# EAGLE design DroneController (EAGLE 9.6.2)

## Sheet 1 of 4
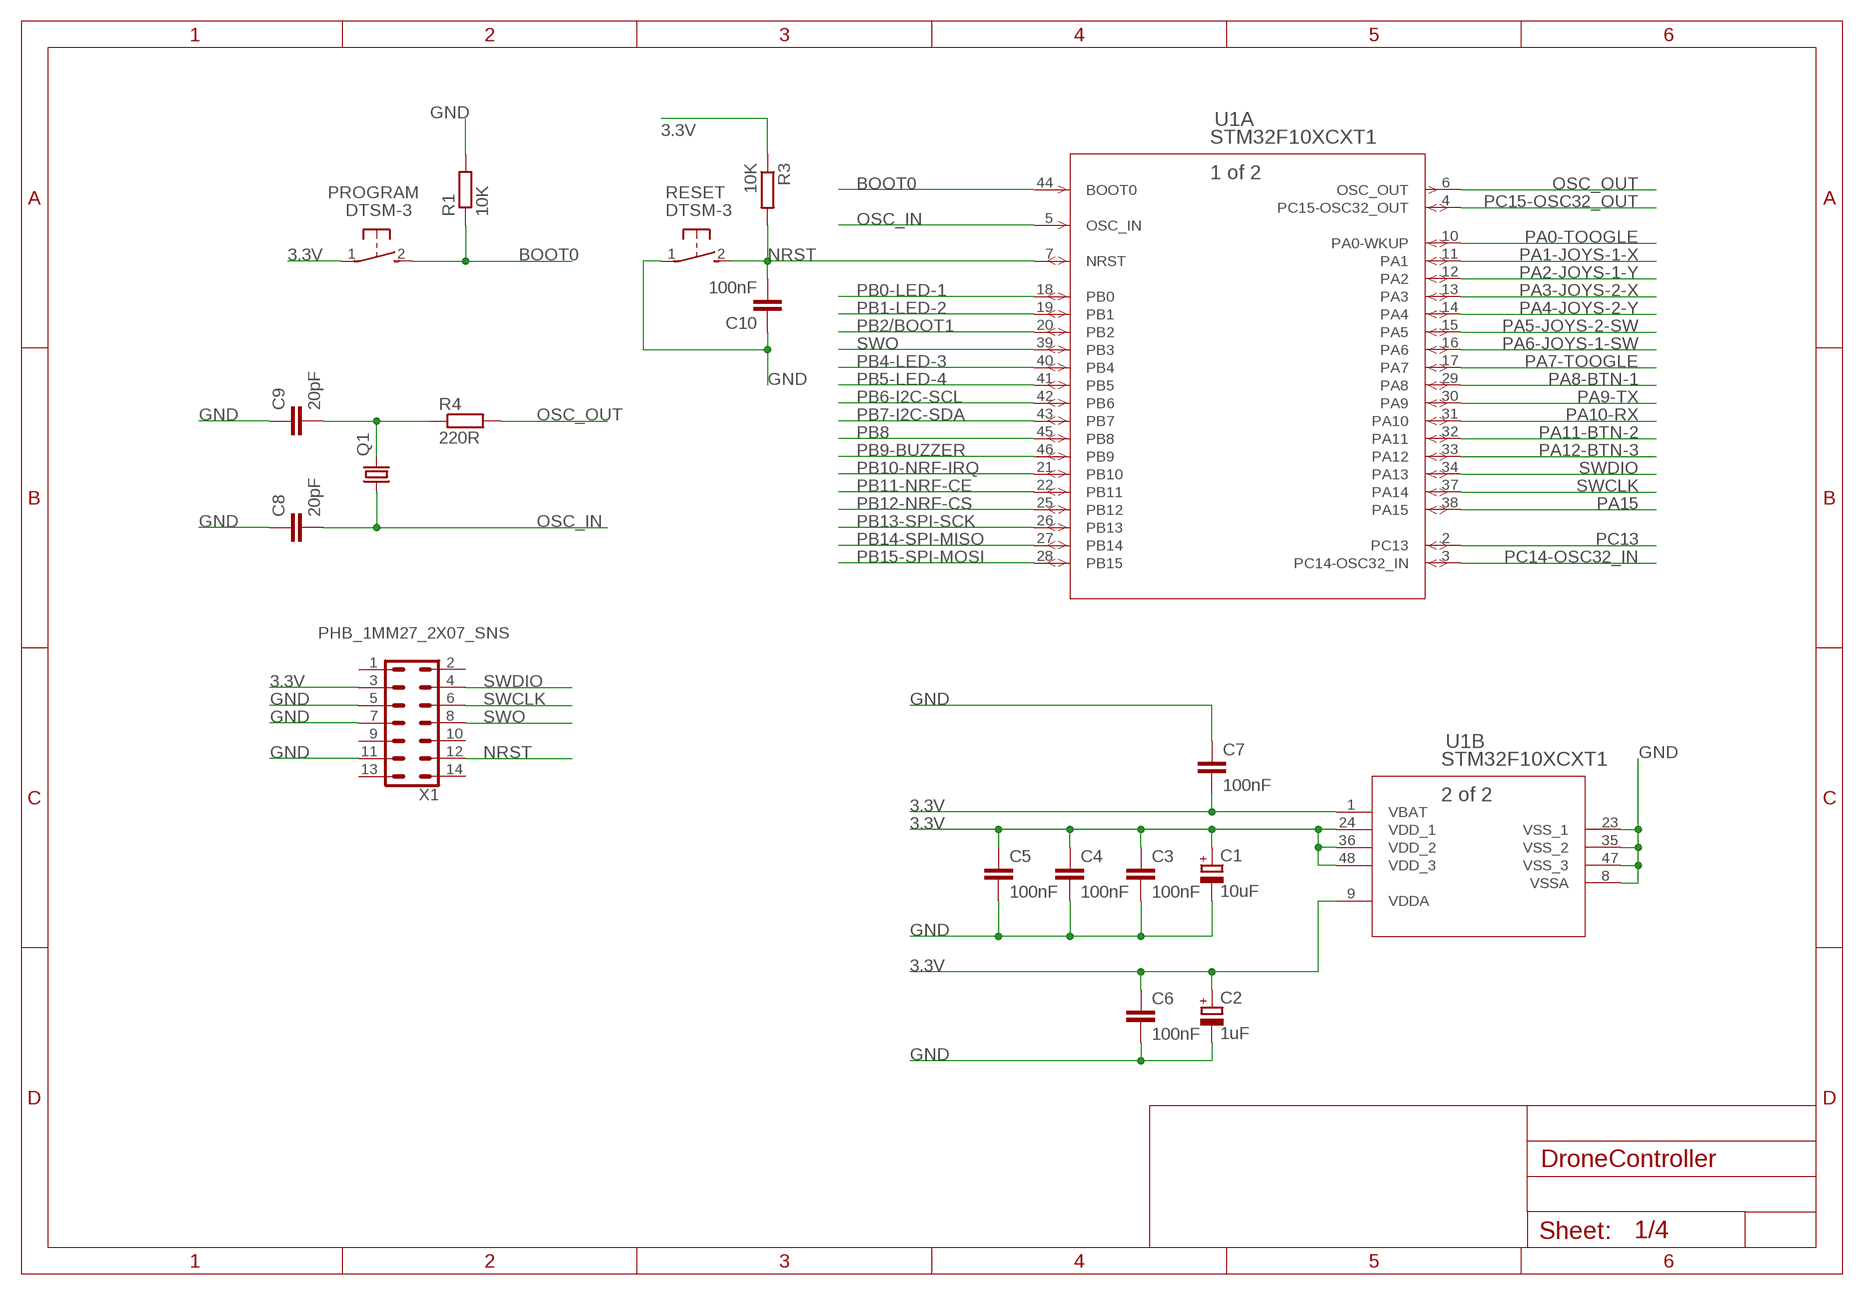
[diagram p0: schematic, sheet 1]

### Parts
C1  10uF  CPOL-EUSMCA  [SMC_A]
C2  1uF  CPOL-EUSMCA  [SMC_A]
C3  100nF  C-EUC0805  [C0805]
C4  100nF  C-EUC0805  [C0805]
C5  100nF  C-EUC0805  [C0805]
C6  100nF  C-EUC0805  [C0805]
C7  100nF  C-EUC0805  [C0805]
C8  20pF  C-EUC0805  [C0805]
C9  20pF  C-EUC0805  [C0805]
C10  100nF  C-EUC0805  [C0805]
PROGRAM  DTSM-3  [DTSM-3]
Q1  CRYSTALHC49S  [HC49/S]
R1  10K  R-EU_R0805  [R0805]
R3  10K  R-EU_R0805  [R0805]
R4  220R  R-EU_R0805  [R0805]
RESET  DTSM-3  [DTSM-3]
U1  STM32F10XCXT1  [LQFP48-7X7MM]
X1  PHB_1MM27_2X07_SNS  [PHB_1MM27_2X07_SNS]

### Nets
3.3V: C1.+ C2.+ C3.1 C4.1 C5.1 C6.1 C7.2 PROGRAM.1 R3.1 U1.1(B:VBAT) U1.9(B:VDDA) U1.24(B:VDD_1) U1.36(B:VDD_2) U1.48(B:VDD_3) X1.3 ; also sheet 2,3,4
BOOT0: PROGRAM.2 R1.1 U1.44(A:BOOT0)
GND: C1.- C2.- C3.2 C4.2 C5.2 C6.2 C7.1 C8.1 C9.1 C10.1 R1.2 RESET.1 U1.8(B:VSSA) U1.23(B:VSS_1) U1.35(B:VSS_2) U1.47(B:VSS_3) X1.5 X1.7 X1.11 ; also sheet 2,3,4
N$5: C9.2 Q1.2 R4.1
NRST: C10.2 R3.2 RESET.2 U1.7(A:NRST) X1.12
OSC_IN: C8.2 Q1.1 U1.5(A:OSC_IN)
OSC_OUT: R4.2 U1.6(A:OSC_OUT)
PA0-TOOGLE: U1.10(A:PA0-WKUP) ; also sheet 3
PA1-JOYS-1-X: U1.11(A:PA1) ; also sheet 3
PA2-JOYS-1-Y: U1.12(A:PA2) ; also sheet 3
PA3-JOYS-2-X: U1.13(A:PA3) ; also sheet 3
PA4-JOYS-2-Y: U1.14(A:PA4) ; also sheet 3
PA5-JOYS-2-SW: U1.15(A:PA5) ; also sheet 3
PA6-JOYS-1-SW: U1.16(A:PA6) ; also sheet 3
PA7-TOOGLE: U1.17(A:PA7)
PA8-BTN-1: U1.29(A:PA8) ; also sheet 3
PA9-TX: U1.30(A:PA9)
PA10-RX: U1.31(A:PA10)
PA11-BTN-2: U1.32(A:PA11) ; also sheet 3
PA12-BTN-3: U1.33(A:PA12) ; also sheet 3
PA15: U1.38(A:PA15)
PB0-LED-1: U1.18(A:PB0) ; also sheet 3
PB1-LED-2: U1.19(A:PB1) ; also sheet 3
PB2/BOOT1: U1.20(A:PB2)
PB4-LED-3: U1.40(A:PB4) ; also sheet 3
PB5-LED-4: U1.41(A:PB5) ; also sheet 3
PB6-I2C-SCL: U1.42(A:PB6) ; also sheet 2
PB7-I2C-SDA: U1.43(A:PB7) ; also sheet 2
PB8: U1.45(A:PB8)
PB9-BUZZER: U1.46(A:PB9)
PB10-NRF-IRQ: U1.21(A:PB10) ; also sheet 2
PB11-NRF-CE: U1.22(A:PB11) ; also sheet 2
PB12-NRF-CS: U1.25(A:PB12) ; also sheet 2
PB13-SPI-SCK: U1.26(A:PB13) ; also sheet 2
PB14-SPI-MISO: U1.27(A:PB14) ; also sheet 2
PB15-SPI-MOSI: U1.28(A:PB15) ; also sheet 2
PC13: U1.2(A:PC13)
PC14-OSC32_IN: U1.3(A:PC14-OSC32_IN)
PC15-OSC32_OUT: U1.4(A:PC15-OSC32_OUT)
SWCLK: U1.37(A:PA14) X1.6
SWDIO: U1.34(A:PA13) X1.4
SWO: U1.39(A:PB3) X1.8
Unconnected: X1.1 X1.2 X1.9 X1.10 X1.13 X1.14

## Sheet 2 of 4
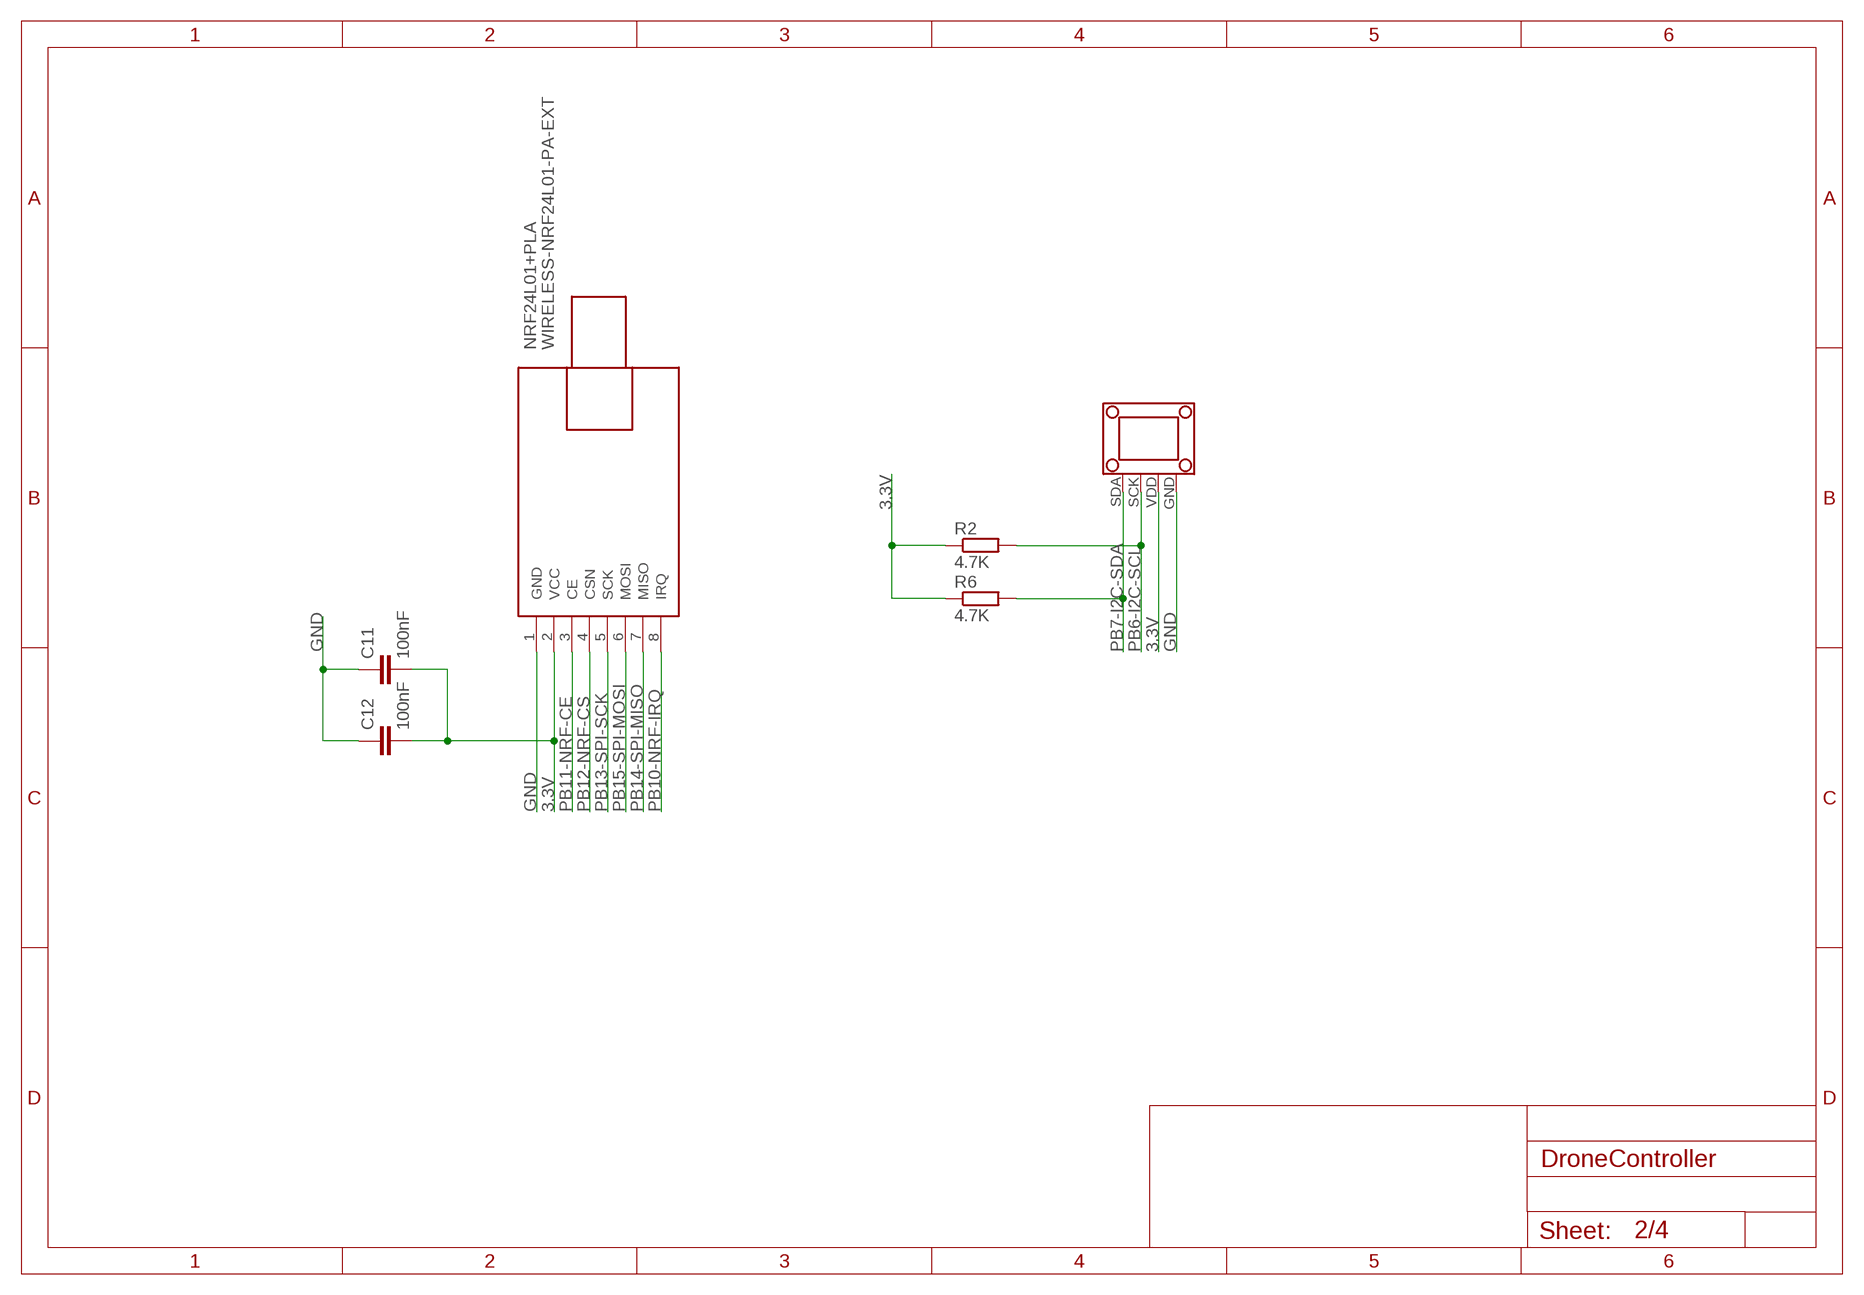
[diagram p1: schematic, sheet 2]

### Parts
C11  100nF  C-EUC0805  [C0805]
C12  100nF  C-EUC0805  [C0805]
NRF24L01+PLA  WIRELESS-NRF24L01-PA-EXT  [WIRELESS-NRF24L01-PA-EXT]
R2  4.7K  R-EU_R0805  [R0805]
R6  4.7K  R-EU_R0805  [R0805]
U$1  1.3_TFT_OLED  [1.3_TFT_OLED]

### Nets
3.3V: C11.2 C12.2 NRF24L01+PLA.2(VCC) R2.1 R6.1 U$1.VDD ; also sheet 1,3,4
GND: C11.1 C12.1 NRF24L01+PLA.1(GND) U$1.GND ; also sheet 1,3,4
PB6-I2C-SCL: R2.2 U$1.SCK ; also sheet 1
PB7-I2C-SDA: R6.2 U$1.SDA ; also sheet 1
PB10-NRF-IRQ: NRF24L01+PLA.8(IRQ) ; also sheet 1
PB11-NRF-CE: NRF24L01+PLA.3(CE) ; also sheet 1
PB12-NRF-CS: NRF24L01+PLA.4(CSN) ; also sheet 1
PB13-SPI-SCK: NRF24L01+PLA.5(SCK) ; also sheet 1
PB14-SPI-MISO: NRF24L01+PLA.7(MISO) ; also sheet 1
PB15-SPI-MOSI: NRF24L01+PLA.6(MOSI) ; also sheet 1

## Sheet 3 of 4
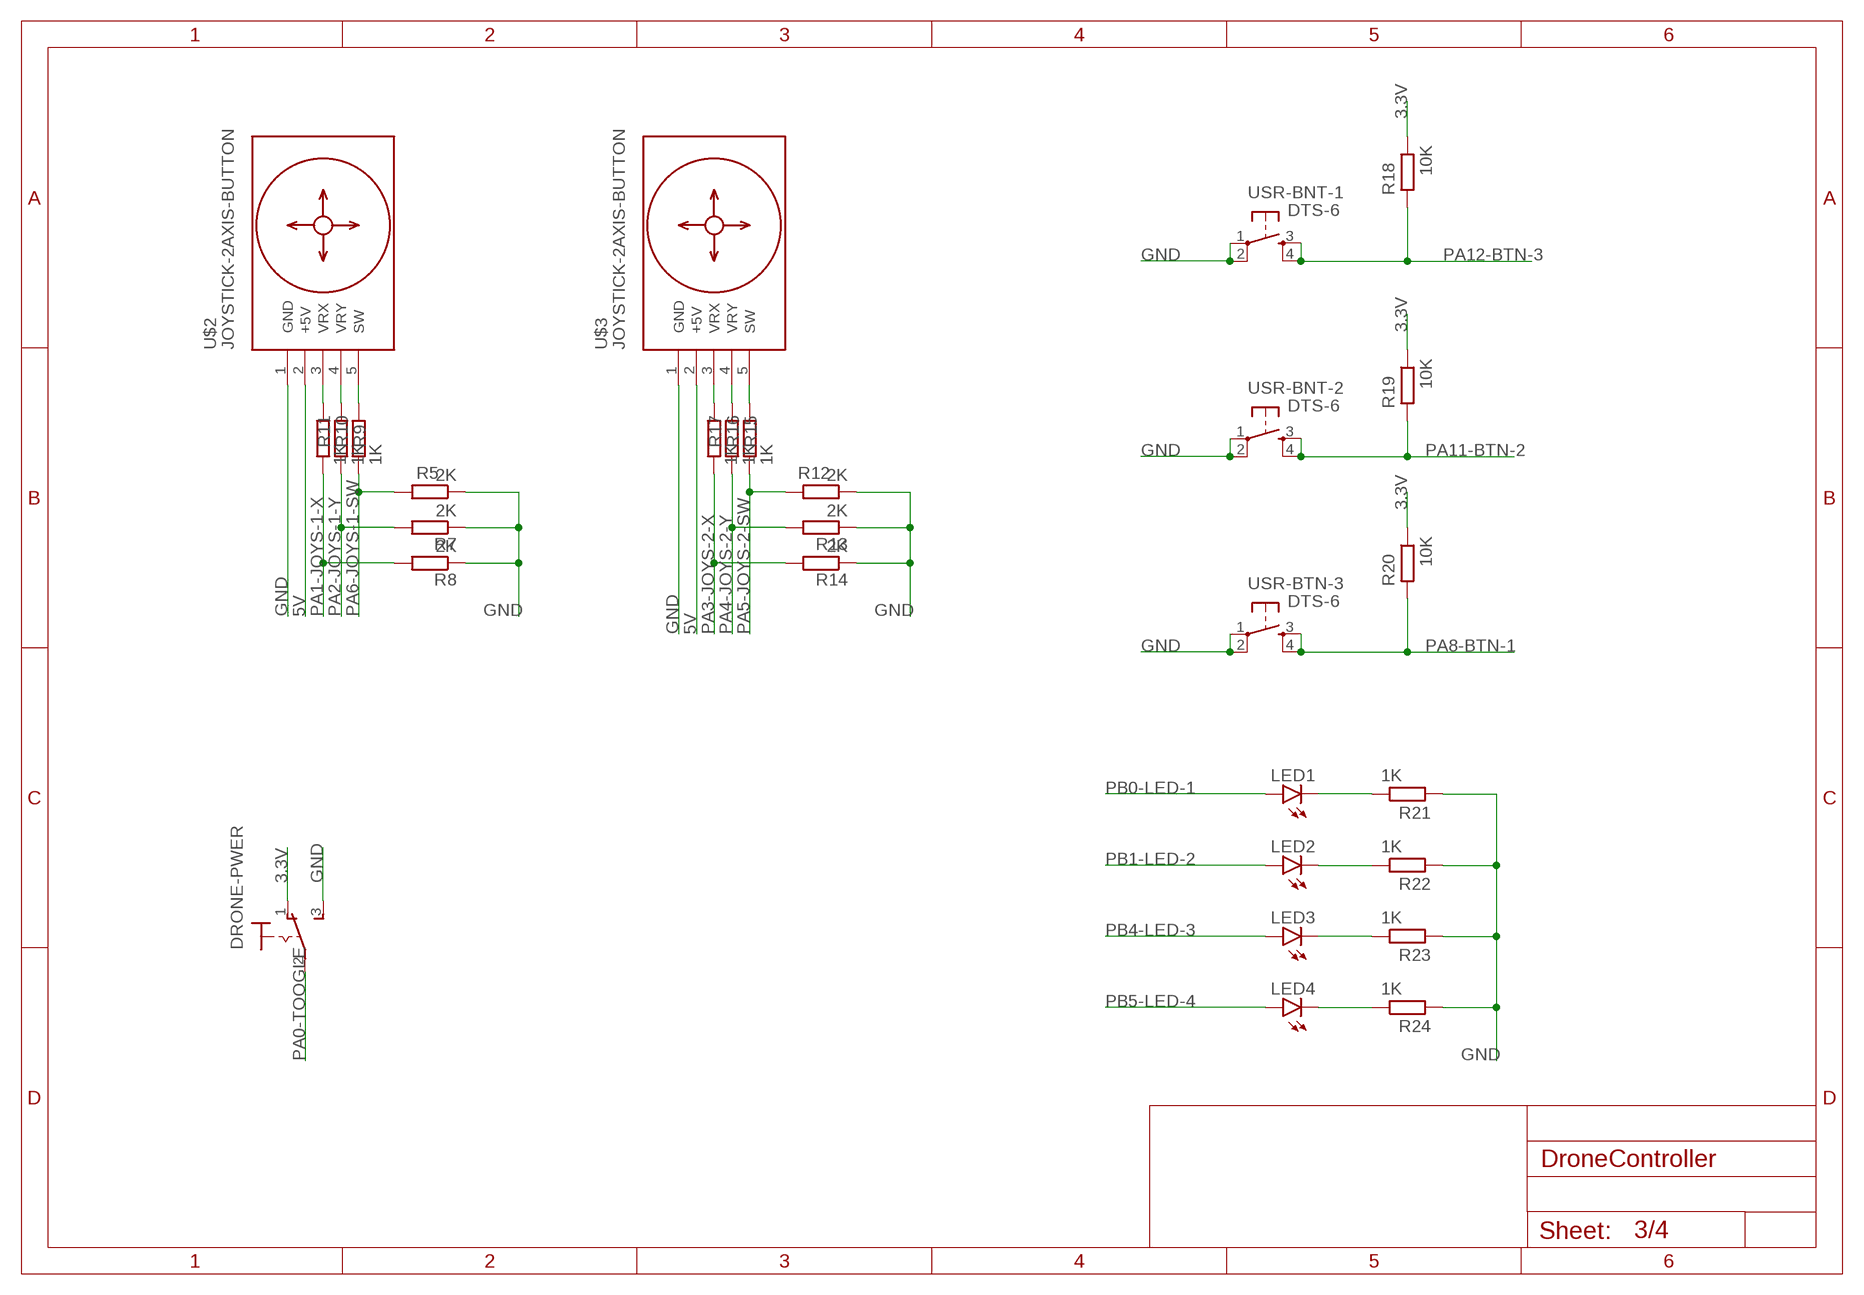
[diagram p2: schematic, sheet 3]

### Parts
DRONE-PWER  M9040P  [M9040P]
LED1  LEDCHIP-LED0805  [CHIP-LED0805]
LED2  LEDCHIP-LED0805  [CHIP-LED0805]
LED3  LEDCHIP-LED0805  [CHIP-LED0805]
LED4  LEDCHIP-LED0805  [CHIP-LED0805]
R5  2K  R-EU_R0805  [R0805]
R7  2K  R-EU_R0805  [R0805]
R8  2K  R-EU_R0805  [R0805]
R9  1K  R-EU_R0805  [R0805]
R10  1K  R-EU_R0805  [R0805]
R11  1K  R-EU_R0805  [R0805]
R12  2K  R-EU_R0805  [R0805]
R13  2K  R-EU_R0805  [R0805]
R14  2K  R-EU_R0805  [R0805]
R15  1K  R-EU_R0805  [R0805]
R16  1K  R-EU_R0805  [R0805]
R17  1K  R-EU_R0805  [R0805]
R18  10K  R-EU_R0805  [R0805]
R19  10K  R-EU_R0805  [R0805]
R20  10K  R-EU_R0805  [R0805]
R21  1K  R-EU_R0805  [R0805]
R22  1K  R-EU_R0805  [R0805]
R23  1K  R-EU_R0805  [R0805]
R24  1K  R-EU_R0805  [R0805]
U$2  JOYSTICK-2AXIS-BUTTON  [JOYSTICK-2AXIS-BUTTON]
U$3  JOYSTICK-2AXIS-BUTTON  [JOYSTICK-2AXIS-BUTTON]
USR-BNT-1  DTS-6  [DTS-6]
USR-BNT-2  DTS-6  [DTS-6]
USR-BTN-3  DTS-6  [DTS-6]

### Nets
3.3V: DRONE-PWER.1(O) R18.1 R19.1 R20.1 ; also sheet 1,2,4
5V: U$2.2(+5V) U$3.2(+5V) ; also sheet 4
GND: DRONE-PWER.3(S) R5.1 R7.1 R8.1 R12.1 R13.1 R14.1 R21.2 R22.2 R23.2 R24.2 U$2.1(GND) U$3.1(GND) USR-BNT-1.1 USR-BNT-1.2 USR-BNT-2.1 USR-BNT-2.2 USR-BTN-3.1 USR-BTN-3.2 ; also sheet 1,2,4
N$1: R11.2 U$2.3(VRX)
N$2: R10.2 U$2.4(VRY)
N$3: R9.2 U$2.5(SW)
N$4: R17.2 U$3.3(VRX)
N$6: R16.2 U$3.4(VRY)
N$7: LED4.C R24.1
N$8: R15.2 U$3.5(SW)
N$10: LED3.C R23.1
N$11: LED2.C R22.1
N$12: LED1.C R21.1
PA0-TOOGLE: DRONE-PWER.2(P) ; also sheet 1
PA1-JOYS-1-X: R8.2 R11.1 ; also sheet 1
PA2-JOYS-1-Y: R7.2 R10.1 ; also sheet 1
PA3-JOYS-2-X: R14.2 R17.1 ; also sheet 1
PA4-JOYS-2-Y: R13.2 R16.1 ; also sheet 1
PA5-JOYS-2-SW: R12.2 R15.1 ; also sheet 1
PA6-JOYS-1-SW: R5.2 R9.1 ; also sheet 1
PA8-BTN-1: R20.2 USR-BTN-3.3 USR-BTN-3.4 ; also sheet 1
PA11-BTN-2: R19.2 USR-BNT-2.3 USR-BNT-2.4 ; also sheet 1
PA12-BTN-3: R18.2 USR-BNT-1.3 USR-BNT-1.4 ; also sheet 1
PB0-LED-1: LED1.A ; also sheet 1
PB1-LED-2: LED2.A ; also sheet 1
PB4-LED-3: LED3.A ; also sheet 1
PB5-LED-4: LED4.A ; also sheet 1

## Sheet 4 of 4
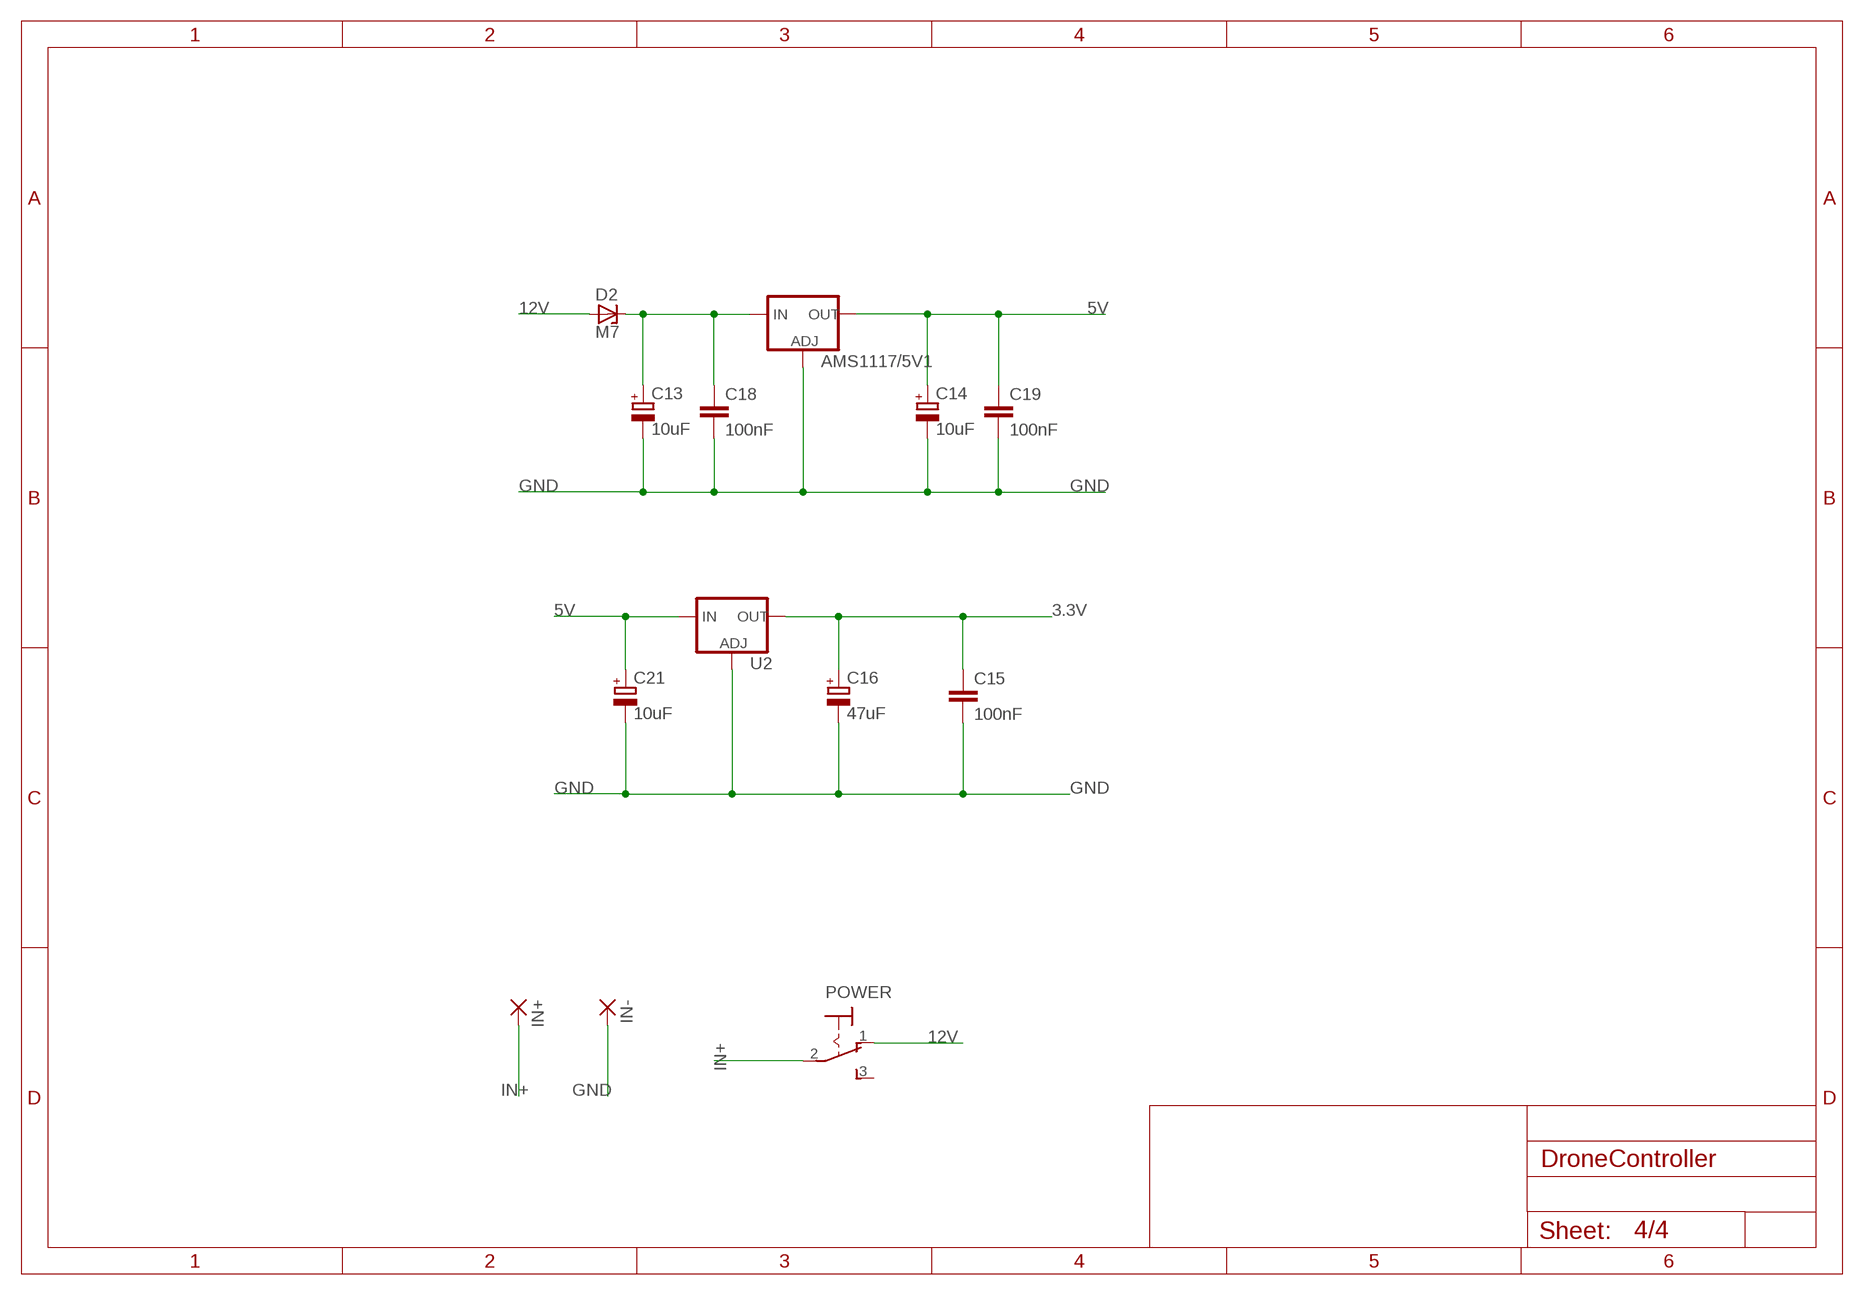
[diagram p3: schematic, sheet 4]

### Parts
AMS1117/5V1  V_REG_LM1117SOT223  [SOT223]
C13  10uF  CPOL-EUSMCA  [SMC_A]
C14  10uF  CPOL-EUSMCA  [SMC_A]
C15  100nF  C-EUC0805  [C0805]
C16  47uF  CPOL-EUSMCB  [SMC_B]
C18  100nF  C-EUC0805  [C0805]
C19  100nF  C-EUC0805  [C0805]
C21  10uF  CPOL-EUSMCA  [SMC_A]
D2  M7  1SMA5913BT3G  [DO214AC]
IN+  2,15/1,0  [2,15/1,0]
IN-  2,15/1,0  [2,15/1,0]
POWER  M9040P  [M9040P]
U2  V_REG_LM1117SOT223  [SOT223]

### Nets
3.3V: C15.1 C16.+ U2.2(OUT) U2.4(OUT) ; also sheet 1,2,3
5V: AMS1117/5V1.2(OUT) AMS1117/5V1.4(OUT) C14.+ C19.1 C21.+ U2.3(IN) ; also sheet 3
12V: D2.A POWER.1(O)
GND: AMS1117/5V1.1(ADJ) C13.- C14.- C15.2 C16.- C18.2 C19.2 C21.- IN-.1(P) U2.1(ADJ) ; also sheet 1,2,3
IN+: IN+.1(P) POWER.2(P)
N$9: AMS1117/5V1.3(IN) C13.+ C18.1 D2.C
Unconnected: POWER.3(S)

## Library data of the parts
AMS1117/5V1 U2 = SparkFun-IC-Power:V_REG_LM1117: Voltage Regulator LM1117 Standard adjustable voltage regulator but in SMD form. Spark Fun Electronics SKU : COM-00595; PROD_ID: VREG-08170
C1 C2 C13 C14 C16 C21 = rcl:CPOL-EU: POLARIZED CAPACITOR, European symbol; SPICEPREFIX: C
C3-C12 C15 C18 C19 = rcl:C-EU: CAPACITOR, European symbol; SPICEPREFIX: C
D2 = 1sma59xx_10:1SMA59*BT3G: 1SMA59xxBT3G Series 1.5 Watt Plastic Surface Mount Zener Voltage Regulators Source: http://www.onsemi.com/pub_link/Collateral/1SMA5913BT3-D.PDF; MF: ON Semiconductor; MPN: 1SMA5913BT3G; OC_FARNELL: 1431138; OC_NEWARK: 26K5252
DRONE-PWER POWER = switch:M9040P: TOGGLE SWITCH Marquardt
IN+ IN- = wirepad:2,15/1,0: THROUGH-HOLE PAD
LED1-LED4 = led:LED: LED OSRAM: - CHIPLED LG R971, LG N971, LY N971, LG Q971, LY Q971, LO R971, LY R971 LH N974, LH R974 LS Q976, LO Q976, LY Q976 LO Q996 - Hyper CHIPLED LW Q18S LB Q993, LB Q99A, LB R99A - SideLED LS A670, LO A670, LY A670, LG A670, LP A670 LB A673, LV A673, LT A673, LW A673 LH A674 LY A675 LS A676, LA A676, LO A676, LY A676, LW A676 LS A679, LY A679, LG A679 - Hyper Micro SIDELED® LS Y876, LA Y876, LO Y876, LY Y876 LT Y87S - SmartLED LW L88C, LW L88S LB L89C, LB L89S, LG L890 LS L89K, LO L89K, LY L89K LS L896, LA L896, LO L896, LY L896 - TOPLED LS T670, LO T670, LY T670, LG T670, LP T670 LSG T670, LSP T670, LSY T670, LOP T670, LYG T670 LG T671, LOG T671, LSG T671 LB T673, LV T673, LT T673, LW T673 LH T674 LS T676, LA T676, LO T676, LY T676, LB T676, LH T676, LSB T676, LW T676 LB T67C, LV T67C, LT T67C, LS T67K, LO T67K, LY T67K, LW E67C LS E67B, LA E67B, LO E67B, LY E67B, LB E67C, LV E67C, LT E67C LW T67C LS T679, LY T679, LG T679 LS T770, LO T770, LY T770, LG T770, LP T770 LB T773, LV T773, LT T773, LW T773 LH T774 LS E675, LA E675, LY E675, LS T675 LS T776, LA T776, LO T776, LY T776, LB T776 LHGB T686 LT T68C, LB T68C - Hyper Mini TOPLED® LB M676 - Mini TOPLED Santana® LG M470 LS M47K, LO M47K, LY M47K Source: http://www.osram.convergy.de LUXEON: - LUMILED® LXK2-PW12-R00, LXK2-PW12-S00, LXK2-PW14-U00, LXK2-PW14-V00 LXK2-PM12-R00, LXK2-PM12-S00, LXK2-PM14-U00 LXK2-PE12-Q00, LXK2-PE12-R00, LXK2-PE12-S00, LXK2-PE14-T00, LXK2-PE14-U00 LXK2-PB12-K00, LXK2-PB12-L00, LXK2-PB12-M00, LXK2-PB14-N00, LXK2-PB14-P00, LXK2-PB14-Q00 LXK2-PR12-L00, LXK2-PR12-M00, LXK2-PR14-Q00, LXK2-PR14-R00 LXK2-PD12-Q00, LXK2-PD12-R00, LXK2-PD12-S00 LXK2-PH12-R00, LXK2-PH12-S00 LXK2-PL12-P00, LXK2-PL12-Q00, LXK2-PL12-R00 Source: www.luxeon.com KINGBRIGHT: KA-3528ASYC Source: www.kingbright.com
NRF24L01+PLA = diy-modules:WIRELESS-NRF24L01-PA-EXT: 2.4 GHz Wireless Module based on NRF24L01 chip with preamplifier and external antenna Click here to find device on ebay.com <http://www.ebay.com/sch/nrf24l01+pa+lna+sma>
PROGRAM RESET = switch-tact:DTSM-3
Q1 = crystal:CRYSTAL: CRYSTAL; OC_FARNELL: 1667008; OC_NEWARK: unknown
R1-R24 = rcl:R-EU_: RESISTOR, European symbol; SPICEPREFIX: R
U1 = STM32F10XCXT1:STM32F10XCXT1; COPYRIGHT: Copyright (C) 2016 Accelerated Designs. All rights reserved; MANUFACTURER_PART_NUMBER: STM32F10XCXT1; VENDOR: STMicroelectronics
U$1 = 1.3 Inch Oled TFT:1.3_TFT_OLED
U$2 U$3 = diy-modules:JOYSTICK-2AXIS-BUTTON: 2-Axis Analog Joystick with Push Button Tutorial is available here: http://henrysbench.capnfatz.com/henrys-bench/arduino-sensors-and-input/arduino-ps2-joystick-tutorial-keyes-ky-023-deek-robot/ Click here to find device on ebay.com <http://www.ebay.com/sch/joystick+ps2+module>
USR-BNT-1 USR-BNT-2 USR-BTN-3 = switch-tact:DTS-6
X1 = pinhead-box-1.27mm:PHB_1MM27_2X07_*: Pin Header Box-Type, 1.27mm/0.5"/50mil Pitch, 2x07 Circuits Note: see library description for an important note about THT-version

## Board
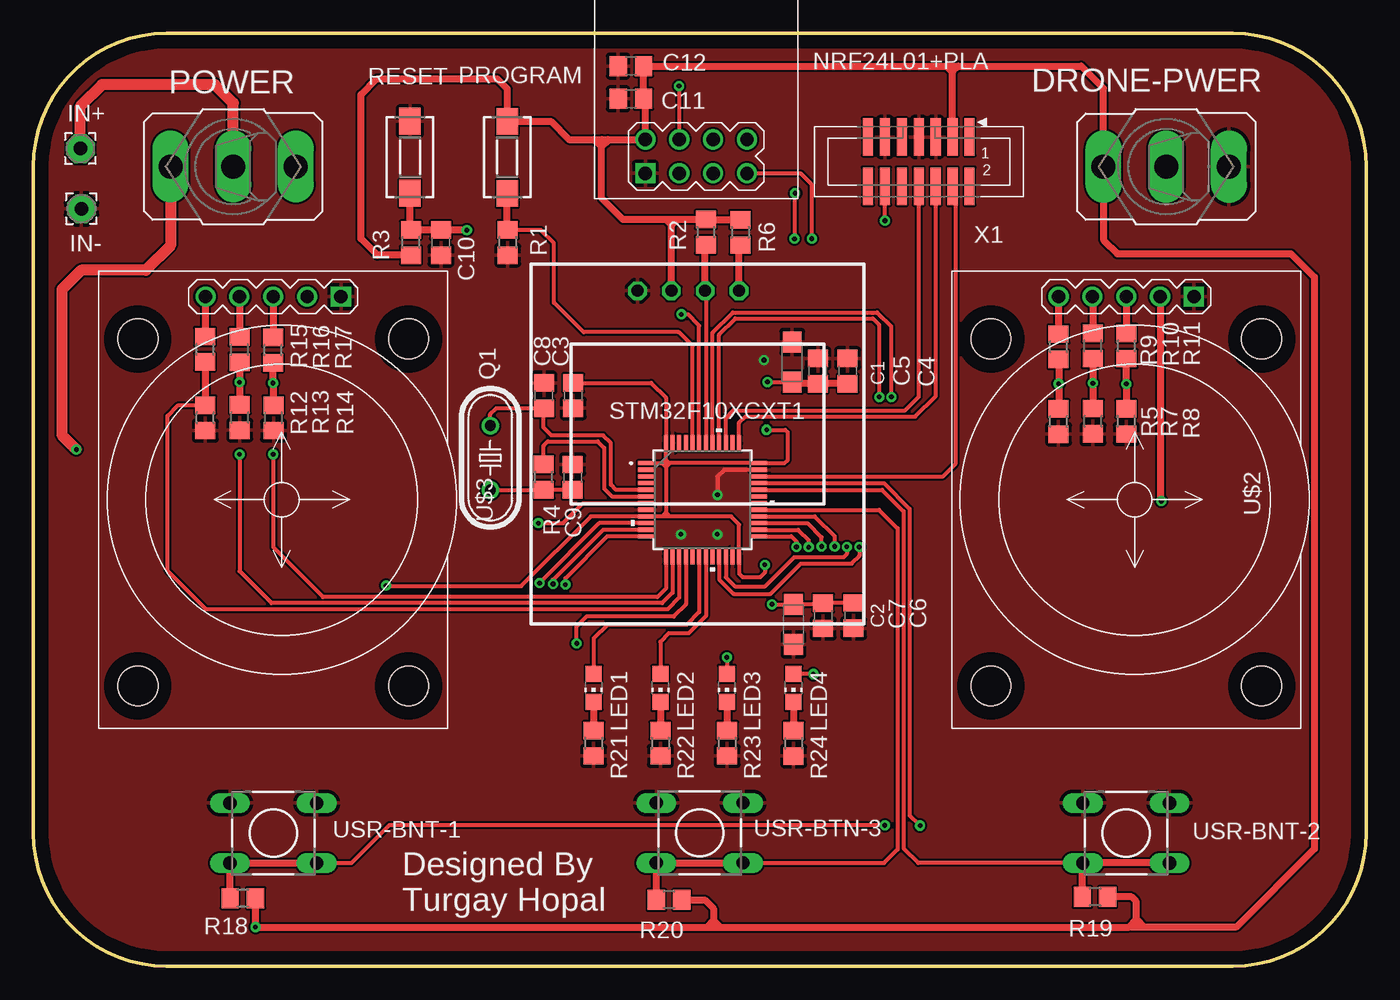
[diagram p4: board, top side]
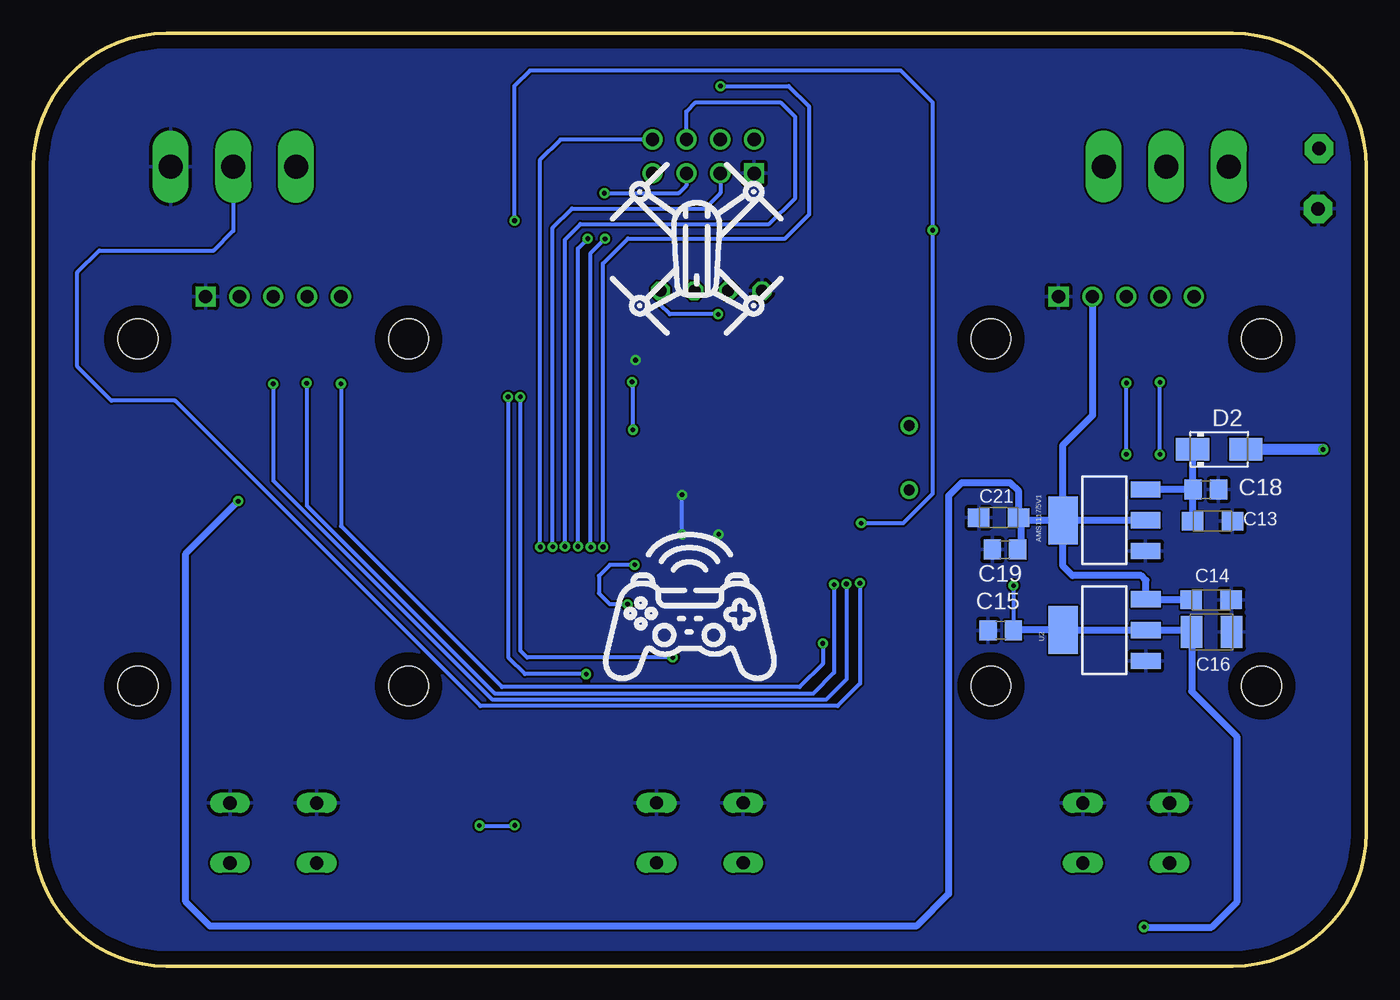
[diagram p5: board, bottom side, seen from below]

Size 100 x 70 mm. Coordinates in mm from the lower left corner, seen from the top.
Outline: 10,0 90,0 arc90 100,10 100,60 arc90 90,70 10,70 arc90 0,60 0,10 arc90 10,0
Copper layers (1*16): Top 0.035mm / dielectric 1.5mm / Bottom 0.035mm
Design rules "default": minimum track width 6mil, minimum drill 0.35mm, track to track 6mil, track to pad 6mil, pad to pad 6mil, via to via 6mil, smd to smd 6mil, copper to edge 40mil, drill to drill 6mil, minimum pad ring 10mil, minimum via ring 8mil, stop-mask expansion 4mil, vias tented up to drill 0mil, thermal gap 10mil

### Footprints (pad centres in the part's own frame; a part is rotated, then mirrored left to right if it is on the bottom)
SOT223 = smd 1.219 x 2.235: 1 -2.311,-3.099; 2 0,-3.099; 3 2.311,-3.099 | smd 3.6 x 2.2: 4 0,3.099
SMC_A = smd 1.6 x 1.4: + -1.5,0; - 1.5,0
C0805 = smd 1.3 x 1.5: 1 -0.95,0; 2 0.95,0
SMC_B = smd 1.6 x 2.4: + -1.5,0; - 1.5,0
DO214AC = smd 2.5 x 1.7: A 2,0; C -2,0
M9040P = drill 1.803 long: 1 0,4.699; 2 0,0; 3 0,-4.699
2,15/1,0 = drill 1.016 pad 2.159 octagon: 1 0,0
CHIP-LED0805 = smd 1.2 x 1.2: A 0,-1.05; C 0,1.05
WIRELESS-NRF24L01-PA-EXT = drill 1 square: 1 -18.415,3.81 | drill 1: 2 -15.875,3.81; 3 -18.415,1.27; 4 -15.875,1.27; 5 -18.415,-1.27; 6 -15.875,-1.27; 7 -18.415,-3.81; 8 -15.875,-3.81
DTSM-3 = smd 2 x 1.6: 1 -2.7,0; 2 2.7,0
HC49/S = drill 0.813: 1 -2.413,0; 2 2.413,0
R0805 = smd 1.3 x 1.5: 1 -0.95,0; 2 0.95,0
LQFP48-7X7MM = smd 1.194 x 0.305: 1 -4.25,2.75; 2 -4.25,2.25; 3 -4.25,1.75; 4 -4.25,1.25; 5 -4.25,0.75; 6 -4.25,0.25; 7 -4.25,-0.25; 8 -4.25,-0.75; 9 -4.25,-1.25; 10 -4.25,-1.75; 11 -4.25,-2.25; 12 -4.25,-2.75; 25 4.25,-2.75; 26 4.25,-2.25; 27 4.25,-1.75; 28 4.25,-1.25; 29 4.25,-0.75; 30 4.25,-0.25; 31 4.25,0.25; 32 4.25,0.75; 33 4.25,1.25; 34 4.25,1.75; 35 4.25,2.25; 36 4.25,2.75 | smd 0.305 x 1.194: 13 -2.75,-4.25; 14 -2.25,-4.25; 15 -1.75,-4.25; 16 -1.25,-4.25; 17 -0.75,-4.25; 18 -0.25,-4.25; 19 0.25,-4.25; 20 0.75,-4.25; 21 1.25,-4.25; 22 1.75,-4.25; 23 2.25,-4.25; 24 2.75,-4.25; 37 2.75,4.25; 38 2.25,4.25; 39 1.75,4.25; 40 1.25,4.25; 41 0.75,4.25; 42 0.25,4.25; 43 -0.25,4.25; 44 -0.75,4.25; 45 -1.25,4.25; 46 -1.75,4.25; 47 -2.25,4.25; 48 -2.75,4.25
1.3_TFT_OLED = drill 0.9 octagon: GND 8,25; SCK 13.08,25; SDA 15.62,25; VDD 10.54,25
JOYSTICK-2AXIS-BUTTON = drill 1 square: 1 -15.24,5.08 | drill 1: 2 -15.24,2.54; 3 -15.24,0; 4 -15.24,-2.54; 5 -15.24,-5.08 | hole 3: -12.065,10.16; -12.065,-10.16; 13.97,-10.16; 13.97,10.16
DTS-6 = drill 1 long: 1 -3.25,2.25; 2 3.25,2.25; 3 -3.25,-2.25; 4 3.25,-2.25
PHB_1MM27_2X07_SNS = smd 0.76 x 2.8: 1 -3.81,-1.85; 2 -3.81,1.85; 3 -2.54,-1.85; 4 -2.54,1.85; 5 -1.27,-1.85; 6 -1.27,1.85; 7 0,-1.85; 8 0,1.85; 9 1.27,-1.85; 10 1.27,1.85; 11 2.54,-1.85; 12 2.54,1.85; 13 3.81,-1.85; 14 3.81,1.85

### Placement (x,y rotation side)
AMS1117/5V1  19.65,33.46 90 bottom
C1  56.93,45.34 90 top
C2  57.03,25.65 270 top
C3  40.5,42.82 270 top
C4  61.09,44.66 90 top
C5  58.86,44.66 90 top
C6  61.55,26.31 270 top
C7  59.26,26.3 90 top
C8  38.3,42.82 270 top
C9  40.47,36.69 270 top
C10  30.58,54.29 90 top
C11  44.83,65.09 0 top
C12  44.83,67.55 0 top
C13  11.53,33.39 0 bottom
C14  11.63,27.5 0 bottom
C15  27.42,25.2 180 bottom
C16  11.59,25.08 0 bottom
C18  12.03,35.76 0 bottom
C19  27.09,31.26 180 bottom
C21  27.57,33.66 180 bottom
D2  11.03,38.8 0 bottom
DRONE-PWER  85,60 90 top
IN+  3.53,61.35 0 top
IN-  3.61,56.83 0 top
LED1  42.05,20.88 180 top
LED2  47.04,20.88 180 top
LED3  52.04,20.88 180 top
LED4  57.04,20.88 180 top
NRF24L01+PLA  49.73,77.91 90 top
POWER  15,60 90 top
PROGRAM  35.56,60.69 270 top
Q1  34.28,38.15 270 top
R1  35.59,54.3 270 top
R2  50.45,55.08 270 top
R3  28.34,54.3 90 top
R4  38.29,36.7 90 top
R5  76.92,40.87 90 top
R6  53.04,55.06 270 top
R7  79.5,40.89 90 top
R8  82,40.88 90 top
R9  76.92,46.48 90 top
R10  79.49,46.55 90 top
R11  82.01,46.54 90 top
R12  12.9,41.15 90 top
R13  15.49,41.17 90 top
R14  18.02,41.15 90 top
R15  12.88,46.3 90 top
R16  15.47,46.27 90 top
R17  17.99,46.23 90 top
R18  15.72,5.1 180 top
R19  79.65,5.19 180 top
R20  47.7,4.98 180 top
R21  42.04,16.73 270 top
R22  47.05,16.73 270 top
R23  52.05,16.73 270 top
R24  57.04,16.72 270 top
RESET  28.25,60.71 270 top
U1  50.21,35 0 top
U2  19.63,25.22 90 bottom
U$1  37.33,25.68 0 top
U$2  82,35 270 top
U$3  18,35 270 top
USR-BNT-1  18,10 0 top
USR-BNT-2  82,10 0 top
USR-BTN-3  50,10 0 top
X1  66.43,60.37 180 top

### Tracks (layer width: path | path; a pad name or v marks a point on that pad's centre or on a via)
3.3V  (via drill 0.35)
  Top 0.305: C6.1 61.54,27.25 C7.2 59.16,27.15 C2.+ v55.43,27.15 | 54.88,30.1 54.88,29.53 54.55,29.2 53.22,29.2 52.96,29.46 U1.24 52.96,33.13 52.34,33.75 47.77,33.75 | 26.49,28.52 36.61,28.52 41.84,33.75 U1.9 47.15,33.75 | C3.1 46.35,43.77 47.46,42.66 U1.48 47.46,38 | U1.1 47.21,37.75 | 47.46,38 47.21,37.75 | 47.77,33.75 47.39,33.75 | 47.39,33.75 47.15,33.75 | 47.46,37.98 47.46,37.46 | 47.46,37.46 47.46,34.06 | 47.46,34.06 47.46,33.82 47.39,33.75 | 47.46,34.06 47.15,33.75 | 47.46,34.06 47.47,34.06 47.77,33.75 | 47.21,37.75 47.21,37.72 47.46,37.46 | 47.69,37.75 U1.36 56.35,37.75 56.6,38 56.6,40.05 56.41,40.25 v55.03,40.25 | 47.69,37.75 47.21,37.75 | 47.46,37.98 47.69,37.75 | 47.46,37.98 47.46,38 | 47.69,37.75 47.69,37.7 47.46,37.46 | v55.09,43.84 C1.+ 57.06,43.71
  Top 0.508: R18.1 v16.67,2.94 50.53,2.94 | 50.53,2.94 51.03,2.94 | 51.03,2.94 51.51,2.94 | 51.51,2.94 82.18,2.94 | 82.75,3.5 82.75,4.86 82.41,5.19 R19.1 | 82.18,2.94 82.75,3.5 | R20.1 50.39,4.98 51.03,4.34 51.03,3.43 | 51.03,3.43 51.03,2.94 | 50.53,2.94 51.03,3.43 | 51.03,3.43 51.51,2.95 51.51,2.94 | DRONE-PWER.1 80.3,54.48 81.32,53.46 94.36,53.46 96.11,51.71 96.11,8.79 90.25,2.94 83.37,2.94 | 83.37,2.94 82.18,2.94 | 82.75,3.5 82.8,3.5 83.37,2.94 | R3.1 25.82,53.35 24.59,54.58 24.59,65.4 25.77,66.58 34.8,66.58 35.56,65.83 PROGRAM.1 38.83,63.39 40.18,62.03 42.08,62.03 | 42.08,62.03 42.63,62.03 | 42.63,62.03 43.11,62.03 | 43.11,62.03 NRF24L01+PLA.2 | 45.92,62.05 45.92,64.95 C11.2 C12.2 68.5,67.55 | X1.3 68.97,67.08 | 68.5,67.55 68.97,67.08 | 68.5,67.55 69.38,67.55 | 69.38,67.55 78.63,67.55 80.3,65.88 80.3,60.03 | 68.97,67.08 68.97,67.15 69.38,67.55 | R6.1 53.02,56.03 R2.1 48.27,56.03 | 47.87,50.75 47.87,55.62 | 48.27,56.03 47.87,55.62 | 48.27,56.03 47.5,56.03 | 47.5,56.03 44.24,56.03 42.63,57.64 42.63,61.48 | 42.63,62.03 42.63,61.48 | 42.63,61.48 42.08,62.03 | 42.63,61.48 43.11,61.96 43.11,62.03 | 47.87,55.62 47.5,55.99 47.5,56.03 | C4.1 C5.1 57.06,43.71 C1.+
  Top 0.61: v55.08,43.84 v55.09,43.84 | v55.02,40.25 v55.03,40.25 | v54.88,30.12 54.88,30.1 | v55.42,27.15 v55.43,27.15 | v26.46,28.56 26.49,28.52
  Top 1.27: NRF24L01+PLA.2 45.92,62.05 | U$1.VDD 47.87,50.75
  Top 2.54: DRONE-PWER.1 80.3,60.03
  Bottom 0.305: v54.89,30.12 56.74,30.12 57.57,29.29 57.57,27.98 56.74,27.15 v55.43,27.15 | 26.46,28.54 26.46,25.23 26.45,25.22 | 55.02,40.26 55.02,43.78 55.07,43.83
  Bottom 0.508: C15.1 26.45,25.22 U2.4 U2.2 13.23,25.22 C16.+ 13.09,20.63 9.72,17.25 9.72,4.8 11.58,2.94 v16.67,2.94
  Bottom 0.61: v26.46,28.56 26.46,28.54 | v16.67,2.94 | v55.08,43.84 55.07,43.83 | v55.02,40.25 55.02,40.26 | v54.88,30.12 v54.89,30.12 | v55.42,27.15 v55.43,27.15
5V  (via drill 0.35)
  Top 0.508: 84.54,50.2 84.54,34.99 v84.63,34.9
  Top 1.27: U$2.2 84.54,50.2
  Bottom 0.508: AMS1117/5V1.2 AMS1117/5V1.4 | AMS1117/5V1.4 25.87,33.46 | 25.87,33.46 C21.+ 26.07,35.64 26.7,36.27 30.35,36.27 31.34,35.29 31.34,5.42 33.74,3.01 86.74,3.01 88.57,4.84 88.57,30.96 v84.63,34.9 | C19.1 25.87,31.53 25.87,33.46 | AMS1117/5V1.4 22.75,39.11 20.54,41.32 20.54,50.22 | C14.+ 16.5,27.5 U2.3 16.53,28.95 16.89,29.31 22.03,29.31 22.75,30.03 AMS1117/5V1.4
  Bottom 1.27: U$3.2 20.54,50.22
12V  (via drill 0.35)
  Top 0.813: 10.3,59.77 10.3,54.07 8.45,52.22 3.58,52.22 2.13,50.78 2.13,39.87 v3.23,38.77
  Top 2.54: POWER.1 10.3,59.77
  Bottom 0.813: v3.23,38.77 9.01,38.77 D2.A
BOOT0
  Top 0.305: U1.44 49.46,46.55 48.44,47.57 41.29,47.57 39.06,49.79 39.06,54.24 38.06,55.25 R1.1
  Top 0.508: R1.1 35.56,55.28 PROGRAM.2
GND  (via drill 0.35)
  Top 0.305: U1.35 51.85,37.25 51.33,36.73 v51.33,35.36
  Bottom 0.305: v51.33,35.36 v51.33,32.41 v51.32,32.4
  other vias: 48.59,32.4 54.82,45.48
  pour Top: -14,77 113,77 113,46 113,-11 48,-11 -14,-11
  pour Bottom: -22,84 122,84 122,44 122,-18 84,-18 -22,-18
IN+
  Top 0.813: 15,60.13 15,64.77 13.61,66.15 5.16,66.15 3.53,64.52 IN+.1
  Top 1.27: IN+.1
  Top 2.54: POWER.2 15,60.13
N$1
  Top 0.508: U$2.3 R11.2
  Top 1.27: U$2.3
N$2
  Top 0.508: 79.49,50.21 R10.2
  Top 1.27: U$2.4 79.49,50.21
N$3
  Top 0.508: 76.92,50.2 R9.2
  Top 1.27: U$2.5 76.92,50.2
N$4
  Top 0.508: U$3.3 R17.2
  Top 1.27: U$3.3
N$5
  Top 0.305: 34.33,35.73 38.27,35.73 R4.1 40.45,35.75 C9.2
  Top 1.27: Q1.2 34.33,35.73
N$6
  Top 0.508: U$3.4 R16.2
  Top 1.27: U$3.4
N$7
  Top 0.508: LED4.C R24.1
N$8
  Top 0.508: 12.88,50.2 R15.2
  Top 1.27: U$3.5 12.88,50.2
N$9
  Bottom 0.508: D2.C 13.03,35.81 C18.1 | C18.1 13.03,35.71 C13.+ | C18.1 AMS1117/5V1.3
N$10
  Top 0.508: LED3.C 52.04,17.69 R23.1
N$11
  Top 0.508: LED2.C 47.04,17.69 R22.1
N$12
  Top 0.508: LED1.C R21.1
NRST  (via drill 0.35)
  Top 0.305: U1.7 45.92,34.71 41.19,34.71 39.81,33.32 39.81,33.3 39.76,33.24 v37.89,33.24 | v63.89,55.95 X1.12
  Top 0.508: RESET.2 28.25,55.34 R3.2 C10.2 32.51,55.24
  Top 0.61: v32.52,55.23 32.51,55.24 | v63.89,55.95 | v37.89,33.24
  Bottom 0.305: v32.52,55.23 32.52,35.45 34.73,33.24 v37.89,33.24 | 32.52,55.24 32.52,64.8 34.92,67.2 62.75,67.2 63.89,66.06 63.89,55.97
  Bottom 0.61: v37.89,33.24 | v32.52,55.23 32.52,55.24 | v63.89,55.95 63.89,55.97
OSC_IN
  Top 0.305: Q1.1 34.28,41.41 34.74,41.87 38.27,41.87 | 38.27,41.87 C8.2 | U1.5 43.72,35.75 43.34,36.13 43.34,39.25 42.76,39.83 38.86,39.83 38.27,40.42 38.27,41.87
  Top 1.27: Q1.1
OSC_OUT
  Top 0.305: R4.2 38.29,39.07 38.6,39.37 42.34,39.37 42.84,38.88 42.84,35.83 43.42,35.25 U1.6
PA0-TOOGLE  (via drill 0.35)
  Top 0.305: U1.10 42.45,33.25 37.98,28.77
  Top 0.61: v37.98,28.75 37.98,28.77
  Bottom 0.305: 37.98,28.73 37.98,21.22 39.67,19.53 66.45,19.53 89.37,42.44 94.15,42.44 96.69,44.98 96.69,52.06 95.05,53.71 86.47,53.71 85,55.19 85,59.82
  Bottom 0.61: v37.98,28.75 37.98,28.73
  Bottom 2.54: DRONE-PWER.2 85,59.82
PA1-JOYS-1-X  (via drill 0.35)
  Top 0.305: U1.11 42.75,32.75 38.99,28.99 38.99,28.69
  Top 0.508: v82.01,43.69 R11.1 | v82,43.69 R8.2
  Top 0.61: v38.99,28.68 38.99,28.69 | v82,43.69 v82.01,43.69
  Bottom 0.305: 38.99,28.66 38.99,21.52 40.53,19.98 65.54,19.98 82,36.45 82,43.68
  Bottom 0.61: v38.99,28.68 38.99,28.66 | v82,43.69 82,43.68
PA2-JOYS-1-Y  (via drill 0.35)
  Top 0.305: U1.12 43.06,32.25 39.92,29.11 39.92,28.65
  Top 0.508: R10.1 v79.49,43.75 | v79.49,43.74 R7.2
  Top 0.61: v39.92,28.64 39.92,28.65 | v79.49,43.75 v79.49,43.74
  Bottom 0.305: 39.92,28.6 39.92,22.03 41.51,20.44 65.35,20.44 79.49,34.58 79.49,43.69
  Bottom 0.61: v39.92,28.64 39.92,28.6 | v79.49,43.75 79.49,43.69
PA3-JOYS-2-X  (via drill 0.35)
  Top 0.305: U1.13 47.46,28.33 46.83,27.7 21.74,27.7 17.99,31.45 17.99,38.37
  Top 0.508: 17.99,43.77 R17.1 | v17.98,43.76 17.98,42.14 R14.2
  Top 0.61: v17.99,38.41 17.99,38.37 | v17.98,43.76 17.99,43.77
  Bottom 0.305: v17.99,38.42 17.99,43.75
  Bottom 0.61: v17.98,43.76 17.99,43.75 | v17.99,38.41 v17.99,38.42
PA4-JOYS-2-Y  (via drill 0.35)
  Top 0.305: U1.14 47.96,28.03 47.17,27.24 17.87,27.24 15.47,29.64 v15.47,38.39
  Top 0.508: R16.1 v15.47,43.82 | 15.47,43.79 15.47,42.14 R13.2
  Top 0.61: v15.47,38.4 v15.47,38.39 | v15.47,43.82 15.47,43.79
  Bottom 0.305: v15.47,38.41 v15.47,43.81
  Bottom 0.61: v15.47,43.82 v15.47,43.81 | v15.47,38.4 v15.47,38.41
PA5-JOYS-2-SW
  Top 0.305: U1.15 48.46,27.65 47.59,26.78 12.96,26.78 10.06,29.67 10.06,41.28 10.88,42.1 12.86,42.1 R12.2
  Top 0.508: R15.1 12.88,42.12 12.86,42.1
PA6-JOYS-1-SW  (via drill 0.35)
  Top 0.305: U1.16 48.96,27.16 48.04,26.24 41.5,26.24 40.77,25.5 40.77,24.25
  Top 0.508: R9.1 v76.92,43.7 | v76.92,43.69 R5.2
  Top 0.61: v40.77,24.22 40.77,24.25 | v76.92,43.7 v76.92,43.69
  Bottom 0.305: 40.77,24.19 40.77,22.69 42.51,20.94 64.85,20.94 76.92,33.02 76.92,43.65
  Bottom 0.61: v40.77,24.22 40.77,24.19 | v76.92,43.7 76.92,43.65
PA8-BTN-1
  Top 0.305: U1.29 63.45,34.25 64.83,32.86 64.83,8.76 63.82,7.75 53.34,7.75
  Top 0.508: R20.2 USR-BTN-3.3 | 46.8,7.75 USR-BTN-3.4
  Top 1.27: USR-BTN-3.3 46.8,7.75 | USR-BTN-3.4 53.34,7.75
PA11-BTN-2
  Top 0.305: U1.32 63.68,35.75 65.29,34.13 65.29,8.85 66.39,7.75 78.68,7.75
  Top 0.508: R19.2 78.7,7.7 USR-BNT-2.3 85.02,7.75
  Top 1.27: USR-BNT-2.3 78.68,7.75 | USR-BNT-2.4 85.02,7.75
PA12-BTN-3  (via drill 0.35)
  Top 0.305: U1.33 63.82,36.25 65.75,34.32 65.75,11.33 v66.52,10.56 | 63.84,10.57 26.7,10.57 23.87,7.75 21.31,7.75
  Top 0.508: R18.2 14.77,7.73 USR-BNT-1.3 | 14.81,7.75 USR-BNT-1.4
  Top 0.61: v63.88,10.57 63.84,10.57 | v66.53,10.55 v66.52,10.56
  Top 1.27: USR-BNT-1.3 14.81,7.75 | USR-BNT-1.4 21.31,7.75
  Bottom 0.305: 66.51,10.55 63.91,10.55
  Bottom 0.61: v63.88,10.57 63.91,10.55 | v66.53,10.55 66.51,10.55
PB0-LED-1
  Top 0.305: U1.18 49.96,26.57 49.01,25.62 43.07,25.62 42.05,24.59 LED1.A
PB1-LED-2
  Top 0.305: U1.19 50.46,26.27 49.16,24.97 47.66,24.97 47.04,24.35 LED2.A
PB4-LED-3  (via drill 0.35)
  Top 0.305: U1.40 51.46,47.39 52.67,48.6 62.98,48.6 63.47,48.11 63.47,42.77 | 52.04,23.16 LED3.A
  Top 0.61: v63.47,42.72 63.47,42.77 | v52.03,23.17 52.04,23.16
  Bottom 0.305: 63.47,42.7 63.47,23.69 62.94,23.17 52.05,23.17
  Bottom 0.61: v63.47,42.72 63.47,42.7 | v52.03,23.17 52.05,23.17
PB5-LED-4  (via drill 0.35)
  Top 0.305: U1.41 50.96,47.53 52.48,49.06 63.3,49.06 64.38,47.98 v64.38,42.72 | 58.47,21.91 57.05,21.91 LED4.A
  Top 0.61: v64.38,42.71 v64.38,42.72 | v58.52,21.91 58.47,21.91
  Bottom 0.305: 64.38,42.68 64.38,23.17 63.12,21.91 v58.52,21.91
  Bottom 0.61: v64.38,42.71 64.38,42.68 | v58.52,21.91
PB6-I2C-SCL
  Top 0.305: 50.46,50.63 U1.42
  Top 0.508: U$1.SCK 50.41,54.09 R2.2
  Top 1.27: U$1.SCK 50.46,50.63
PB7-I2C-SDA  (via drill 0.35)
  Top 0.305: U1.43 49.96,48.06 49.1,48.92 v48.62,48.92
  Top 0.508: 52.95,50.73 52.95,54.02 R6.2
  Top 0.61: v48.62,48.92
  Top 1.27: U$1.SDA 52.95,50.73
  Bottom 0.305: 48.63,48.92 52.25,48.92 52.95,49.62 U$1.SDA
  Bottom 0.61: v48.62,48.92 48.63,48.92
  Bottom 1.27: U$1.SDA
PB10-NRF-IRQ  (via drill 0.35)
  Top 0.305: U1.21 51.46,29.02 52.54,27.94 55.31,27.94 57.59,30.22 61.4,30.22 61.97,30.79 61.97,31.43
  Top 0.61: v61.97,31.45 61.97,31.43
  Bottom 0.305: 61.97,31.47 61.97,60.52 60.46,62.03 53.56,62.03
  Bottom 0.61: v61.97,31.45 61.97,31.47
  Bottom 1.27: NRF24L01+PLA.8 53.56,62.03
PB11-NRF-CE  (via drill 0.35)
  Top 0.305: U1.22 51.96,29.18 52.64,28.5 54.9,28.5 57.1,30.7 60.82,30.7 61.03,30.92 v61.03,31.45
  Top 0.61: v61.03,31.46 v61.03,31.45
  Bottom 0.305: v61.03,31.46 61.03,55.41 59.59,56.85 49.62,56.85 48.46,58.01 48.46,59.44
  Bottom 0.61: v61.03,31.46
  Bottom 1.27: NRF24L01+PLA.3 48.46,59.44
PB12-NRF-CS  (via drill 0.35)
  Top 0.305: U1.25 56.87,32.25 57.26,31.86 v57.26,31.46 | v48.45,66.03 48.45,62.05
  Top 0.61: v48.45,66.04 v48.45,66.03 | v57.26,31.46
  Top 1.27: NRF24L01+PLA.4 48.45,62.05
  Bottom 0.305: 57.26,31.48 57.26,52.73 55.39,54.6 43.59,54.6 41.77,56.43 41.77,64.48 43.33,66.04 48.42,66.04
  Bottom 0.61: v48.45,66.04 48.42,66.04 | v57.26,31.46 57.26,31.48
PB13-SPI-SCK  (via drill 0.35)
  Top 0.305: U1.26 57.37,32.75 58.18,31.94 58.18,31.46 | 57.11,58.01 57.11,54.62
  Top 0.61: v57.11,54.58 57.11,54.62 | v57.16,58.01 57.11,58.01 | v58.18,31.45 58.18,31.46
  Bottom 0.305: v58.18,31.45 58.18,53.51 57.13,54.56 | 57.14,58.01 51.56,58.01 51,58.57 51,59.45
  Bottom 0.61: v57.16,58.01 57.14,58.01 | v57.11,54.58 57.13,54.56 | v58.18,31.45
  Bottom 1.27: NRF24L01+PLA.5 51,59.45
PB14-SPI-MISO  (via drill 0.35)
  Top 0.305: U1.27 58.08,33.25 59.14,32.19 59.14,31.5 | 58.4,54.61 58.4,58.64 57.55,59.49 53.57,59.49
  Top 0.61: v58.4,54.59 58.4,54.61 | v59.14,31.49 59.14,31.5
  Top 1.27: NRF24L01+PLA.7 53.57,59.49
  Bottom 0.305: 59.14,31.5 59.14,53.86 58.42,54.57
  Bottom 0.61: v58.4,54.59 58.42,54.57 | v59.14,31.49 59.14,31.5
PB15-SPI-MOSI  (via drill 0.35)
  Top 0.305: U1.28 58.61,33.75 60.12,32.23 60.12,31.53
  Top 0.61: v60.12,31.5 60.12,31.53
  Bottom 0.305: v60.12,31.5 60.12,54.51 58.95,55.68 44.8,55.68 42.84,57.65 42.84,63.71 43.9,64.78 50.36,64.78 51,64.14 51,62.07
  Bottom 0.61: v60.12,31.5
  Bottom 1.27: NRF24L01+PLA.6 51,62.07
SWCLK
  Top 0.305: U1.37 52.96,40.78 53.42,41.24 66.15,41.24 67.7,42.79 X1.6
SWDIO
  Top 0.305: U1.34 68.25,36.75 69.17,37.67 69.17,58.32 X1.4
SWO
  Top 0.305: U1.39 51.96,41.15 52.51,41.7 65.39,41.7 66.43,42.73 X1.8

### Text on the board
tPlace: Designed By / Turgay Hopal
bPlace: C:/Users/Turgay Hopal/Desktop/game-controller.bmp